# EAGLE schematic signal_test (EAGLE 6.2)
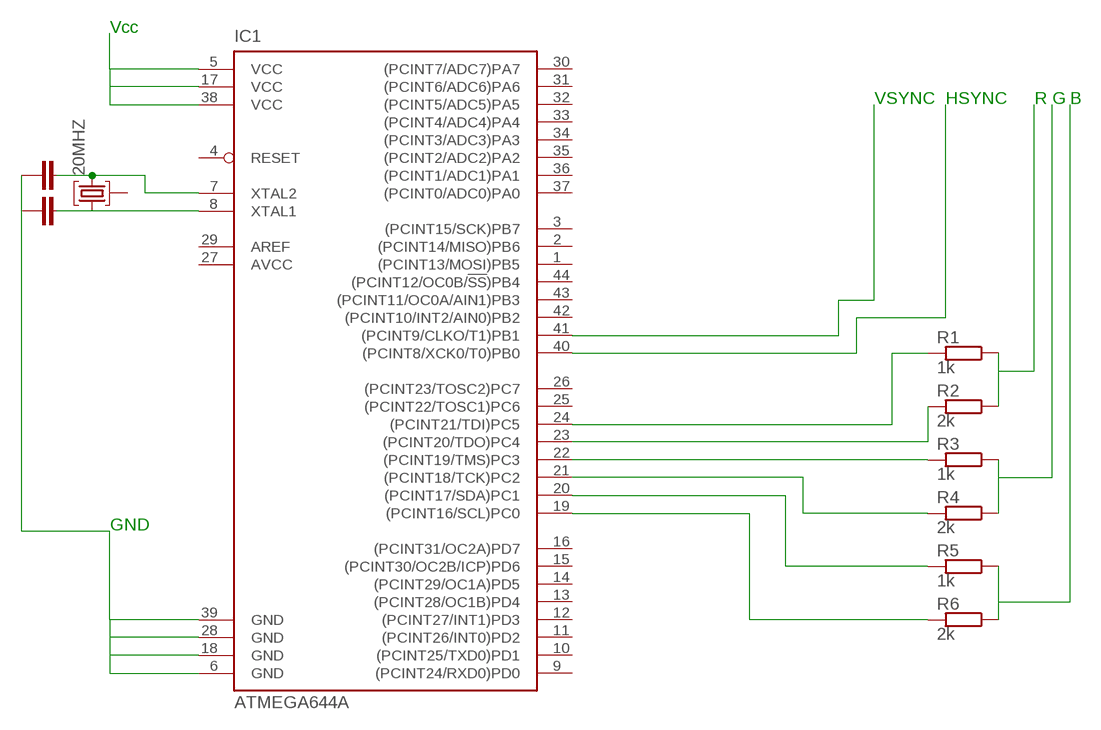
[diagram p0: schematic, sheet 1]

## Parts
20MHZ  12M10AHC49HT  [HC49U]
IC1  ATMEGA644A  [TQFP44]
R1  1k  BVS  [BVS]
R2  2k  BVS  [BVS]
R3  1k  BVS  [BVS]
R4  2k  BVS  [BVS]
R5  1k  BVS  [BVS]
R6  2k  BVS  [BVS]

## Nets
N$1: IC1.5(VCC) IC1.17(VCC) IC1.38(VCC)
N$2: IC1.6(GND) IC1.18(GND) IC1.28(GND) IC1.39(GND)
N$3: IC1.19((PCINT16/SCL)PC0) R6.2
N$4: IC1.20((PCINT17/SDA)PC1) R5.2
N$5: IC1.21((PCINT18/TCK)PC2) R4.2
N$6: IC1.22((PCINT19/TMS)PC3) R3.2
N$7: IC1.23((PCINT20/TDO)PC4) R2.2
N$8: IC1.24((PCINT21/TDI)PC5) R1.2
N$9: 20MHZ.3 IC1.7(XTAL2)
N$10: IC1.8(XTAL1)
N$11: R5.1 R6.1
N$12: R3.1 R4.1
N$13: R1.1 R2.1
N$14: IC1.40((PCINT8/XCK0/T0)PB0)
N$15: IC1.41((PCINT9/CLKO/T1)PB1)
Unconnected: 20MHZ.1 20MHZ.2 IC1.1((PCINT13/MOSI)PB5) IC1.2((PCINT14/MISO)PB6) IC1.3((PCINT15/SCK)PB7) IC1.4(RESET) IC1.9((PCINT24/RXD0)PD0) IC1.10((PCINT25/TXD0)PD1) IC1.11((PCINT26/INT0)PD2) IC1.12((PCINT27/INT1)PD3) IC1.13((PCINT28/OC1B)PD4) IC1.14((PCINT29/OC1A)PD5) IC1.15((PCINT30/OC2B/ICP)PD6) IC1.16((PCINT31/OC2A)PD7) IC1.25((PCINT22/TOSC1)PC6) IC1.26((PCINT23/TOSC2)PC7) IC1.29(AREF) IC1.30((PCINT7/ADC7)PA7) IC1.31((PCINT6/ADC6)PA6) IC1.32((PCINT5/ADC5)PA5) IC1.33((PCINT4/ADC4)PA4) IC1.34((PCINT3/ADC3)PA3) IC1.35((PCINT2/ADC2)PA2) IC1.36((PCINT1/ADC1)PA1) IC1.37((PCINT0/ADC0)PA0) IC1.42((PCINT10/INT2/AIN0)PB2) IC1.43((PCINT11/OC0A/AIN1)PB3) IC1.44((PCINT12/OC0B/!SS!)PB4)

## Notes on the sheet
- Vcc
- VSYNC | HSYNC | R | G | B
- GND

## Power pins joined to a net without a drawn wire
AVCC: IC1.27(AVCC)

## Library data of the parts
20MHZ = crystal:12M10AHC49HT: Monolithic Crystal Filters Source: www.vanlong.com; OC_FARNELL: unknown; OC_NEWARK: unknown
IC1 = atmel:ATMEGA644: 8-bit Microcontroller with 64K Bytes In-System Programmable Flash Source: http://www.atmel.com/dyn/resources/prod_documents/doc2593.pdf; MPN: ATMEGA644PV-10AU; OC_FARNELL: 1455123; OC_NEWARK: 58M3748
R1-R6 = resistor-shunt:BVS: SMD SHUNT RESISTOR; OC_FARNELL: unknown; OC_NEWARK: unknown